# EAGLE design AEMLIC-V1 (EAGLE 9.6.2)
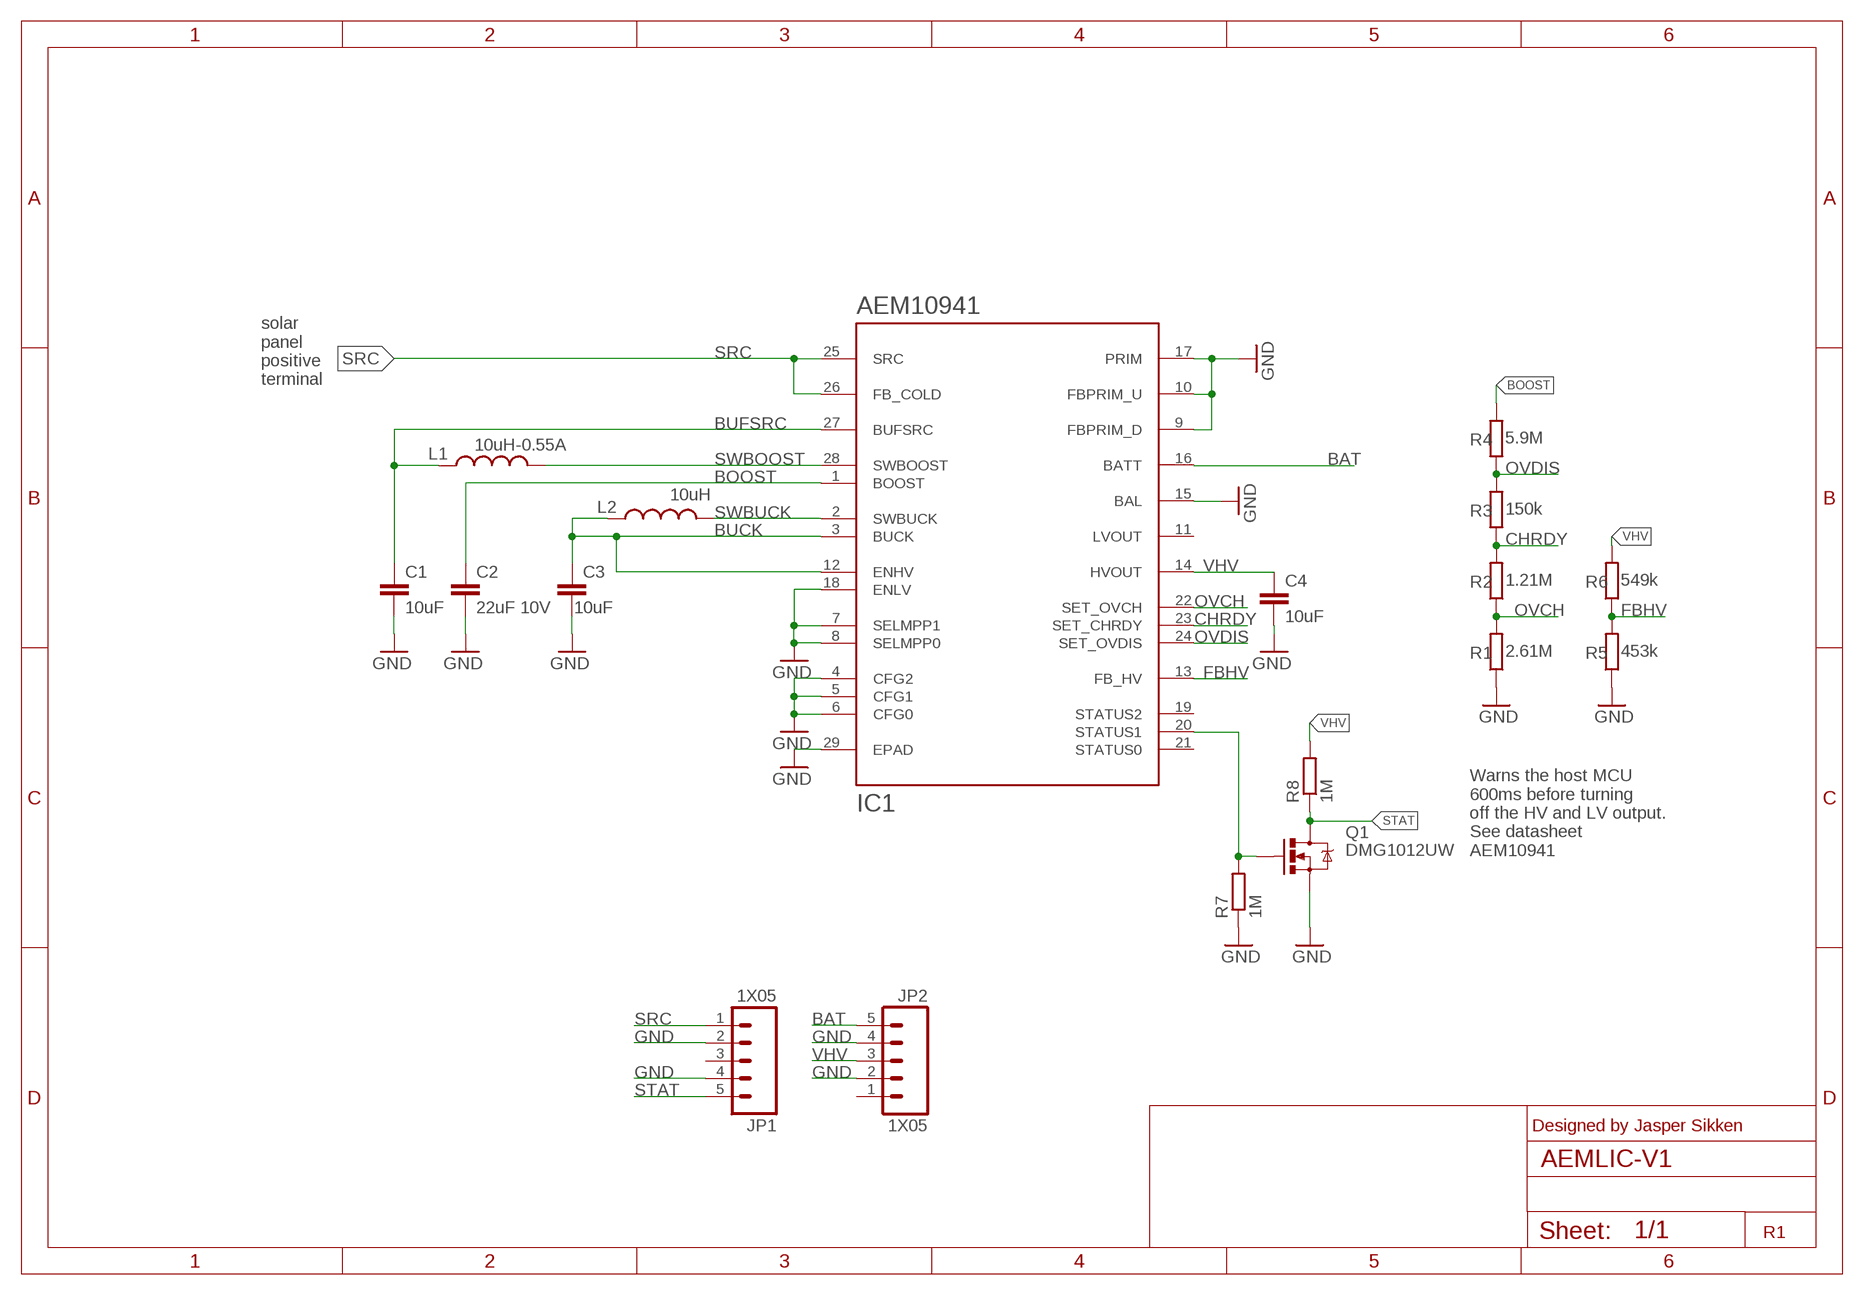
[diagram p0: schematic, sheet 1]

## Parts
C1  10uF  C0603_10UF  [C0603]
C2  22uF 10V  C0603_22UF  [C0603]
C3  10uF  C0603_10UF  [C0603]
C4  10uF  C0603_10UF  [C0603]
IC1  AEM10941  [QFN50P505X505X90-28]
JP1  1X05  [1X05_2.54MM_ROUND_NOSILK]
JP2  1X05  [1X05_2.54MM_ROUND_NOSILK]
L1  10uH-0.55A  L3.9X3.9_10UH_0.55A  [LPS4012]
L2  10uH  L0603_10UH  [L0603]
Q1  DMG1012UW  MOSFET-N-CHANNEL_DMG1012UW  [SOT323]
R1  2.61M  R0402_1M  [R0402]
R2  1.21M  R0402_1M  [R0402]
R3  150k  R0402_1M  [R0402]
R4  5.9M  R0402_1M  [R0402]
R5  453k  R0402_1M  [R0402]
R6  549k  R0402_1M  [R0402]
R7  1M  R0402_1M  [R0402]
R8  1M  R0402_1M  [R0402]

## Nets
BAT: IC1.16(BATT) JP2.5
BOOST: C2.1 IC1.1(BOOST) R4.2
BUCK: C3.1 IC1.3(BUCK) IC1.12(ENHV) L2.1
BUFSRC: C1.1 IC1.27(BUFSRC) L1.1
CHRDY: IC1.23(SET_CHRDY) R2.2 R3.1
FBHV: IC1.13(FB_HV) R5.2 R6.1
GND: C1.2 C2.2 C3.2 C4.2 IC1.4(CFG2) IC1.5(CFG1) IC1.6(CFG0) IC1.7(SELMPP1) IC1.8(SELMPP0) IC1.9(FBPRIM_D) IC1.10(FBPRIM_U) IC1.15(BAL) IC1.17(PRIM) IC1.18(ENLV) IC1.29(EPAD) JP1.2 JP1.4 JP2.2 JP2.4 Q1.2(S) R1.1 R5.1 R7.1
OVCH: IC1.22(SET_OVCH) R1.2 R2.1
OVDIS: IC1.24(SET_OVDIS) R3.2 R4.1
SRC: IC1.25(SRC) IC1.26(FB_COLD) JP1.1
STAT: JP1.5 Q1.3(D) R8.1
STATUS1: IC1.20(STATUS1) Q1.1(G) R7.2
SWBOOST: IC1.28(SWBOOST) L1.2
SWBUCK: IC1.2(SWBUCK) L2.2
VHV: C4.1 IC1.14(HVOUT) JP2.3 R6.2 R8.2
Unconnected: IC1.11(LVOUT) IC1.19(STATUS2) IC1.21(STATUS0) JP1.3 JP2.1

## Notes on the sheet
- solar
  panel
  positive
  terminal
- Warns the host MCU
  600ms before turning
  off the HV and LV output. 
  See datasheet
  AEM10941
- Designed by Jasper Sikken
- R1

## Library data of the parts
C1 C3 C4 = TSEM:C: Non-polarized capacitor; FARNELL_OC: 2113070; MF: KEYSTONE; MPN: 1049P; OC_NEWARK: 53Y2625
C2 = TSEM:C: Non-polarized capacitor; FARNELL_OC: 2426957; MF: TDK; MPN: CGA5L1X7S1A226M160AC; OC_NEWARK: 71AH2845
IC1 = TSEM:AEM10941: Ambient Energy Manager from e-peas; OC_NEWARK: unknown
JP1 JP2 = TSEM:1X05; OC_NEWARK: unknown
L1 = TSEM:L: Inductor; FARNELL_OC: 2408076; MF: BOURNS; MPN: SRN2009T-100M; OC_NEWARK: 43AC9502
L2 = TSEM:L: Inductor; FARNELL_OC: 2215635; MF: TAIYO YUDEN; MPN: CK2125100M-T; OC_NEWARK: 25AC6883
Q1 = TSEM:MOSFET-N-CHANNEL: Mosfet N channel; FARNELL_OC: 2061403; OC_NEWARK: unknown
R1-R6 = TSEM:R: Resistor; FARNELL_OC: 2502499; OC_NEWARK: unknown; VALUE: 1M
R7 R8 = TSEM:R: Resistor; FARNELL_OC: 2502499; OC_NEWARK: unknown

## Board
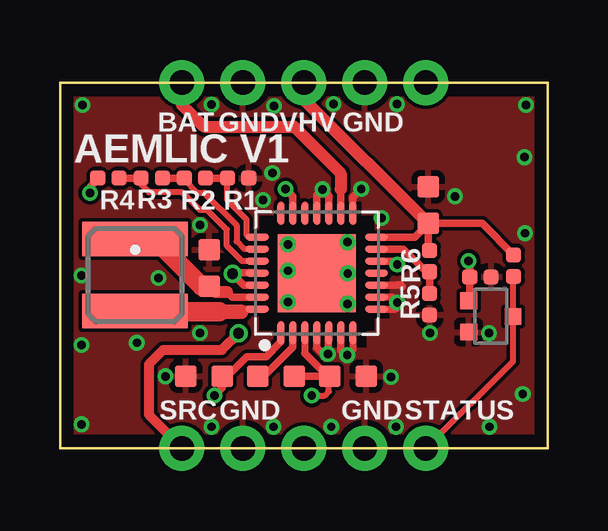
[diagram p1: board, top side]
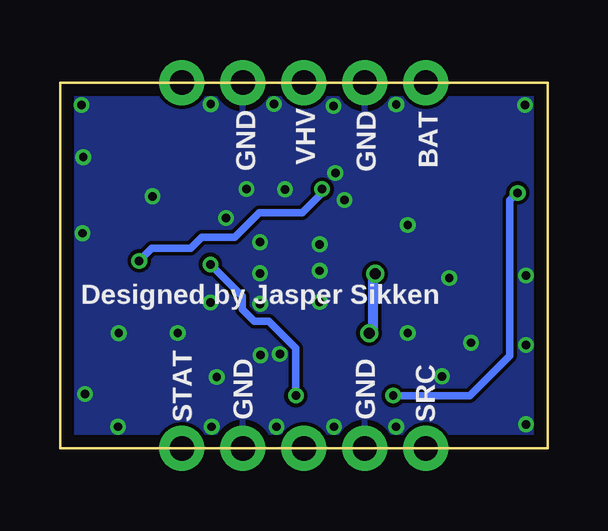
[diagram p2: board, bottom side, seen from below]

Size 20.32 x 15.24 mm. Coordinates in mm from the lower left corner, seen from the top.
Outline: 0,0 0,15.24 20.32,15.24 20.32,0 0,0
Copper layers (1*16): Top 0.035mm / dielectric 1.6mm / Bottom 0.035mm
Design rules "Elecrow_2-layer_PCB_eagle_rule *": minimum track width 6mil, minimum drill 12mil, track to track 6mil, track to pad 6mil, pad to pad 6mil, via to via 6mil, smd to smd 0mil, copper to edge 20mil, drill to drill 10mil, minimum pad ring 6mil, minimum via ring 6mil, stop-mask expansion 0mil, vias tented up to drill 100mil, thermal gap 10mil
tRestrict: area 12.7,5.4 to 13.7,7.1; area 10.5,4.2 to 11.7,5.2; area 12,9.7 to 12.6,10.3; area 11.6,4.2 to 12.8,5.2; area 10.4,9.3 to 11.5,10.4

### Footprints (pad centres in the part's own frame; a part is rotated, then mirrored left to right if it is on the bottom)
C0603 = smd 0.889 x 0.889: 1 -0.762,0; 2 0.762,0
QFN50P505X505X90-28 = smd 0.977 x 0.292: 1 -2.486,1.5; 2 -2.486,1; 3 -2.486,0.5; 4 -2.486,0; 5 -2.486,-0.5; 6 -2.486,-1; 7 -2.486,-1.5; 15 2.486,-1.5; 16 2.486,-1; 17 2.486,-0.5; 18 2.486,0; 19 2.486,0.5; 20 2.486,1; 21 2.486,1.5 | smd 0.292 x 0.977: 8 -1.5,-2.486; 9 -1,-2.486; 10 -0.5,-2.486; 11 0,-2.486; 12 0.5,-2.486; 13 1,-2.486; 14 1.5,-2.486; 22 1.5,2.486; 23 1,2.486; 24 0.5,2.486; 25 0,2.486; 26 -0.5,2.486; 27 -1,2.486; 28 -1.5,2.486 | smd 3.25 x 3.25: 29 0,0
1X05_2.54MM_ROUND_NOSILK = drill 1.016 pad 1.88: 1 0,0; 2 2.54,0; 3 5.08,0; 4 7.62,0; 5 10.16,0
LPS4012 = smd 1.45 x 4.4: 1 -1.5,0; 2 1.5,0
L0603 = smd 0.889 x 0.889: 1 -0.762,0; 2 0.762,0
SOT323 = smd 0.7 x 0.7: 1 -0.65,-0.925; 2 0.65,-0.925; 3 0,0.925
R0402 = smd 0.635 x 0.635: 1 -0.445,0; 2 0.445,0

### Placement (x,y rotation side)
C1  6.22,7.52 90 top
C2  6,3 180 top
C3  12,3 0 top
C4  15.34,10.13 90 top
IC1  10.7,7.3 90 top
JP1  5.08,0 0 top
JP2  15.24,15.24 180 top
L1  3.13,7.22 270 top
L2  9,3 180 top
Q1  17.95,5.5 270 top
R1  7.42,11.26 180 top
R2  5.62,11.26 180 top
R3  3.82,11.26 180 top
R4  2.02,11.26 180 top
R5  15.4,6 90 top
R6  15.4,7.8 90 top
R7  17.52,7.14 180 top
R8  18.9,7.61 90 top

### Tracks (layer width: path | path; a pad name or v marks a point on that pad's centre or on a via)
BAT
  Top 0.305: IC1.16 11.7,10.8
  Top 0.508: 11.7,10.8 11.69,10.81 11.69,11.46 9.75,13.4 5.99,13.4 5.08,14.31 JP2.5
BOOST  (via drill 0.35)
  Top 0.305: IC1.1 9.2,4.43 8.59,3.82 7.79,3.82 6.97,3 C2.1 6.76,2.53 v6.43,2.2 v6.43,2.19 | R4.2 1.57,11.22 1.25,10.89 v1.25,10.64
  Bottom 0.305: v6.43,2.19 3.25,2.19 1.58,3.86 1.58,10.34 1.28,10.64 v1.25,10.64
BUCK  (via drill 0.35)
  Top 0.254: v10.49,2.2 11.03,2.2 11.2,2.37 11.2,2.96 11.16,3
  Top 0.3: IC1.3 10.2,3.96
  Top 0.305: IC1.12 13.91,7.8 v14.05,7.66 | 10.2,3.96 11.16,3 | L2.1 11.16,3 | 11.16,3 C3.1
  Bottom 0.305: v10.49,2.2 10.49,4.16 11.63,5.3 12.23,5.3 12.72,5.79 12.72,6.33 v14.05,7.66
BUFSRC
  Top 0.305: IC1.27 7.17,6.3 6.96,6.51
  Top 0.508: 6.96,6.51 6.47,6.51 C1.1
  Top 0.813: L1.1 3.94,8.72 5.9,6.76 C1.1
CHRDY
  Top 0.254: IC1.23 7.68,8.3 7.36,8.62 7.36,9.29 5.99,10.66 5.72,10.66 5.18,11.2 R2.2
  Top 0.305: R3.1 R2.2
FBHV
  Top 0.305: IC1.13 14.31,8.3 15.25,7.36 R6.1 R5.2
GND  (via drill 0.35)
  Top 0.152: 10.32,7.87 9.85,7.4 v9.5,7.4 | 10.32,7.87 10.32,7.68 IC1.29 10.7,7.5 10.32,7.87
  Top 0.3: IC1.9 13.85,6.3 13.97,6.18 13.97,6.15 v14.05,6.07 14.05,5.87 13.98,5.8 IC1.8 | IC1.7 12.2,4.11 v11.97,3.88 | IC1.15 12.2,10.31
  Top 0.305: 11.7,6.3 IC1.29 12.07,8.67 12.04,8.67 | IC1.4 10.7,4.2 10.98,3.92 v11.15,3.92 v11.16,3.93 v11.17,3.94 11.17,4.78 IC1.5 | 12.2,10.31 12.2,10.46 v12.55,10.81 | IC1.18 10.7,10.55 v10.94,10.79 | v10.94,10.79 11.13,10.6 11.13,10.57 | IC1.17 11.2,10.53 v10.94,10.79 | IC1.10 14.04,6.8 14.05,6.81 14.18,6.81 14.25,6.74 | IC1.6 11.7,4.08 11.9,3.88 v11.97,3.88
  other vias: 3.2,4.4 14,0.9 9.5,8.5 9.5,6.1 11.98,6.02 11.99,7.29 11.98,8.59 0.9,1 8.9,0.9 11.3,0.9 17.9,0.9 5.83,4.8 0.9,7.2 0.9,4.3 17.87,4.8 13.4,9.6 8.85,11.48 16.46,10.5 19.42,14.3 15.41,4.8 6.31,0.9 19.35,12.13 19.28,2.26 5.83,9.31 4.1,7.1 19.38,8.96 4.4,3 13.79,2.97 8.92,14.26 6.31,14.33 8.46,10.35 0.94,14.31 14.04,14.34 11.4,14.35
  pour Top: 0,15.24 20.32,15.24 20.32,0 0,0
  pour Bottom: 0,15.24 20.32,15.24 20.32,0 0,0
OVCH
  Top 0.254: R1.2 6.97,10.33 7.76,9.54 7.76,8.91 7.87,8.8 IC1.22
  Top 0.305: R2.1 R1.2
OVDIS
  Top 0.152: 3.4,11.26 R3.2
  Top 0.254: 3.4,11.26 3.4,10.98 3.71,10.66 5.1,10.66 5.84,9.92 6.14,9.92 6.95,9.11 6.95,8.44 7.59,7.8 IC1.24
  Top 0.305: R4.1 R3.2
SRC  (via drill 0.45)
  Top 0.305: IC1.25 7.23,7.31 v7.19,7.27 7.66,6.8 IC1.26
  Top 0.406: v7.44,4.8 6.74,4.1 4.3,4.1 3.7,3.5 3.7,1.4 5.08,0.02 JP1.1
  Bottom 0.406: v7.19,7.27 7.29,7.17 7.29,4.95 v7.44,4.8
STAT
  Top 0.254: JP1.5 18.88,3.63 Q1.3 18.88,7.14 R8.1
STATUS1  (via drill 0.35)
  Top 0.305: IC1.20 9.7,10.5 v9.4,10.8 | Q1.1 17.08,6.2 R7.2 17.08,7.76 v17.02,7.81
  Bottom 0.305: v17.02,7.81 16.5,8.33 14.86,8.33 14.4,8.79 13.03,8.79 12.01,9.81 10.23,9.81 9.4,10.64 v9.4,10.8
SWBOOST
  Top 0.305: L1.2 3.1,5.69 | IC1.28 7.67,5.8 7.56,5.69
  Top 0.61: 7.56,5.69 6.64,5.69
  Top 0.813: 6.64,5.69 3.1,5.69
SWBUCK
  Top 0.305: IC1.2 9.7,4.22 8.48,3 L2.2
VHV
  Top 0.305: R6.2 15.34,8.3 C4.1 | R8.2 17.59,9.37 C4.1 | C4.1 14.77,8.8 IC1.14
  Top 0.508: JP2.3 10.2,15.2 10.2,14.49 15.32,9.37 C4.1

### Text on the board
tPlace: BAT | GND | VHV | GND | AEMLIC V1 | SRC | GND | GND | STATUS
bPlace: BAT | GND | VHV | GND | Designed by Jasper Sikken | SRC | GND | GND | STAT